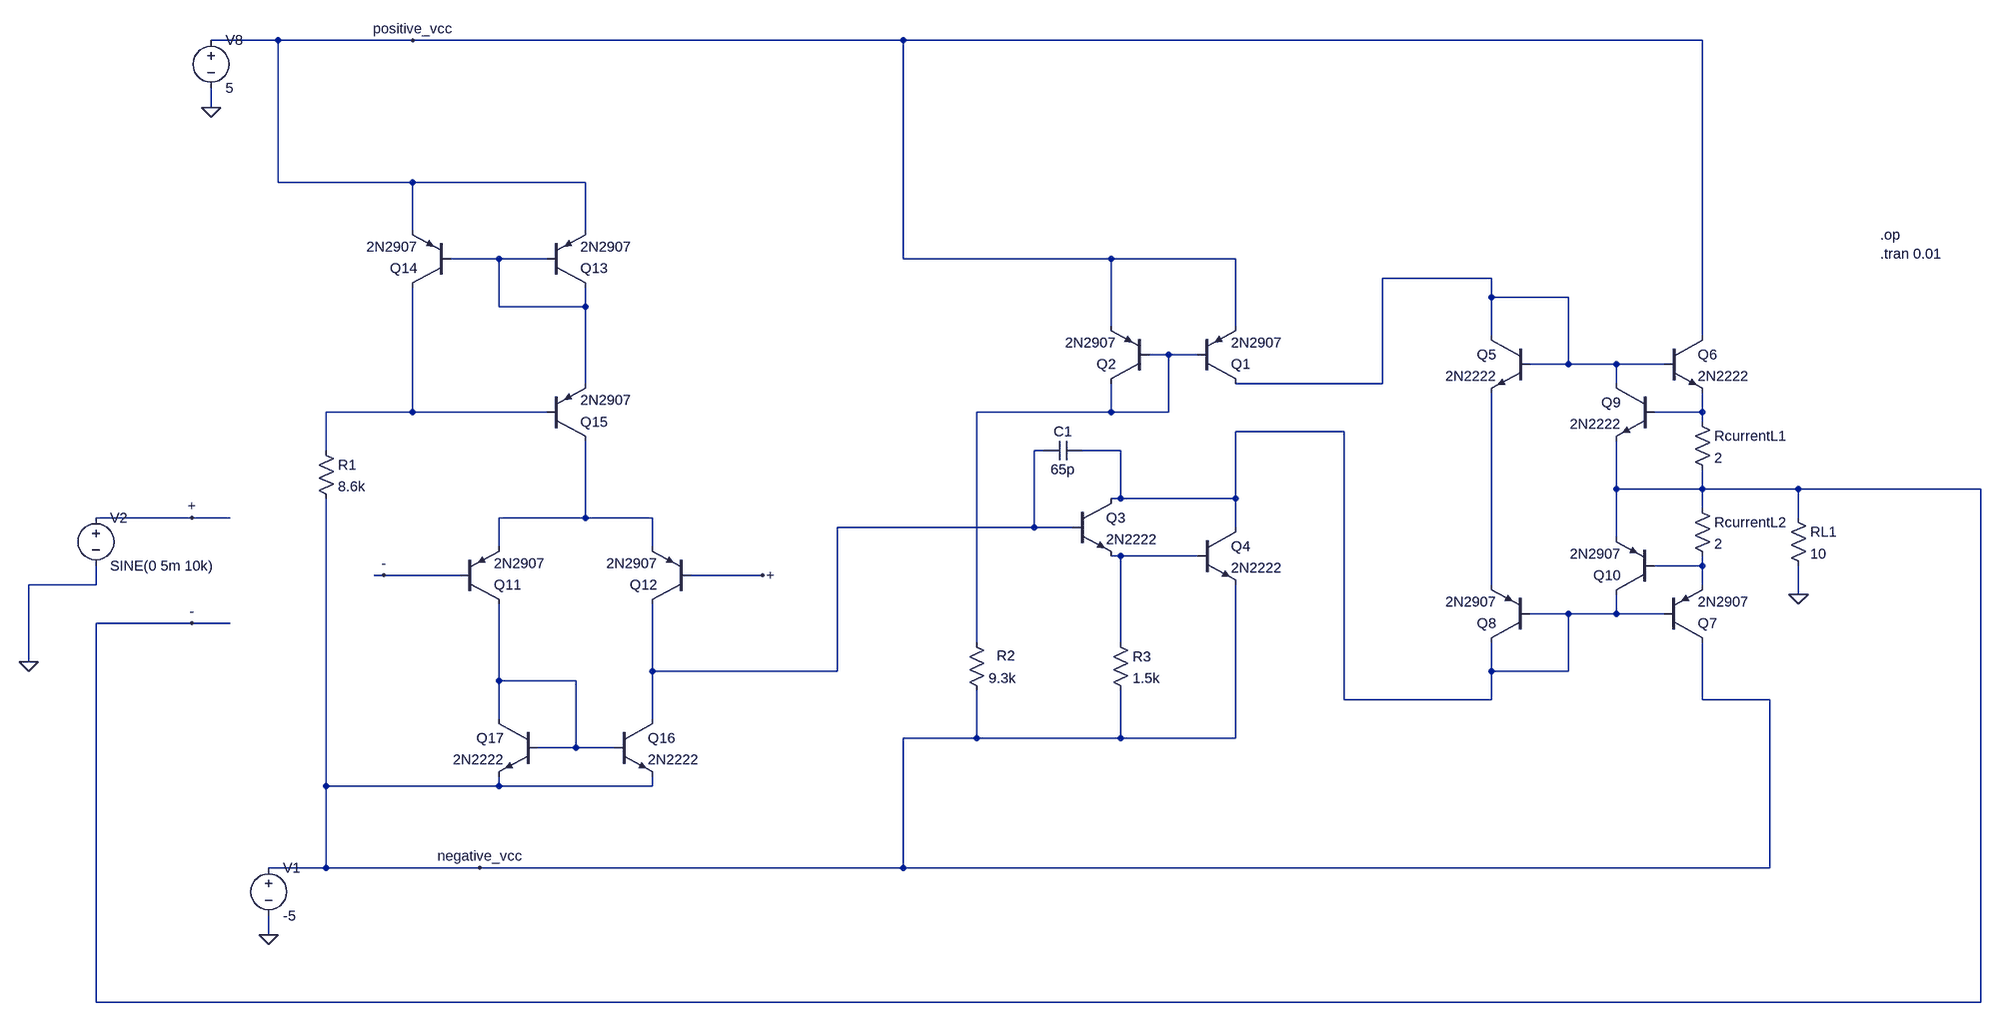
[diagram p0: schematic block3.asc]
block3.asc, the LTspice schematic file:
Version 4
SHEET 1 2168 2020
WIRE -1520 -672 -1632 -672
WIRE -1296 -672 -1520 -672
WIRE -208 -672 -1296 -672
WIRE 1440 -672 -208 -672
WIRE -1632 -560 -1632 -592
WIRE -1520 -160 -1520 -672
WIRE -1296 -160 -1520 -160
WIRE -1008 -160 -1296 -160
WIRE -1296 -80 -1296 -160
WIRE -1008 -80 -1008 -160
WIRE -1152 -32 -1232 -32
WIRE -1072 -32 -1152 -32
WIRE -208 -32 -208 -672
WIRE 192 -32 -208 -32
WIRE 400 -32 192 -32
WIRE 1088 0 848 0
WIRE 1088 32 1088 0
WIRE 1216 32 1088 32
WIRE -1152 48 -1152 -32
WIRE -1008 48 -1008 16
WIRE -1008 48 -1152 48
WIRE 192 80 192 -32
WIRE 400 80 400 -32
WIRE 1088 96 1088 32
WIRE 1440 96 1440 -672
WIRE 288 128 256 128
WIRE 336 128 288 128
WIRE 1216 144 1216 32
WIRE 1216 144 1152 144
WIRE 1296 144 1216 144
WIRE 1376 144 1296 144
WIRE -1008 176 -1008 48
WIRE 848 176 848 0
WIRE 848 176 400 176
WIRE 1296 176 1296 144
WIRE -1296 224 -1296 16
WIRE -1296 224 -1440 224
WIRE -1072 224 -1296 224
WIRE 192 224 192 176
WIRE 192 224 -32 224
WIRE 288 224 288 128
WIRE 288 224 192 224
WIRE 1440 224 1440 192
WIRE 1440 224 1360 224
WIRE 1440 240 1440 224
WIRE 784 256 400 256
WIRE -1440 288 -1440 224
WIRE 80 288 64 288
WIRE 208 288 144 288
WIRE 1296 352 1296 272
WIRE 1440 352 1440 320
WIRE 1440 352 1296 352
WIRE 1600 352 1440 352
WIRE 1904 352 1600 352
WIRE 208 368 208 288
WIRE 208 368 192 368
WIRE 400 368 400 256
WIRE 400 368 208 368
WIRE 1440 384 1440 352
WIRE -1664 400 -1824 400
WIRE -1600 400 -1664 400
WIRE -1008 400 -1008 272
WIRE -1008 400 -1152 400
WIRE -896 400 -1008 400
WIRE 1600 400 1600 352
WIRE 64 416 64 288
WIRE 64 416 -336 416
WIRE 128 416 64 416
WIRE 400 416 400 368
WIRE 1296 432 1296 352
WIRE -1152 448 -1152 400
WIRE -896 448 -896 400
WIRE 208 464 192 464
WIRE 336 464 208 464
WIRE 1440 480 1440 464
WIRE 1440 480 1360 480
WIRE -1344 496 -1360 496
WIRE -1216 496 -1344 496
WIRE -544 496 -832 496
WIRE -1824 512 -1824 480
WIRE -1824 512 -1936 512
WIRE 1088 512 1088 192
WIRE 1440 512 1440 480
WIRE 1600 528 1600 480
WIRE 1216 560 1152 560
WIRE 1296 560 1296 528
WIRE 1296 560 1216 560
WIRE 1376 560 1296 560
WIRE -1664 576 -1824 576
WIRE -1600 576 -1664 576
WIRE -32 608 -32 224
WIRE 208 608 208 464
WIRE -1936 640 -1936 512
WIRE -896 656 -896 544
WIRE -336 656 -336 416
WIRE -336 656 -896 656
WIRE 1088 656 1088 608
WIRE 1216 656 1216 560
WIRE 1216 656 1088 656
WIRE -1152 672 -1152 544
WIRE -1024 672 -1152 672
WIRE 784 704 784 256
WIRE 1088 704 1088 656
WIRE 1088 704 784 704
WIRE 1440 704 1440 608
WIRE 1552 704 1440 704
WIRE -1152 736 -1152 672
WIRE -896 736 -896 656
WIRE -32 768 -32 688
WIRE -32 768 -208 768
WIRE 208 768 208 688
WIRE 208 768 -32 768
WIRE 400 768 400 512
WIRE 400 768 208 768
WIRE -1024 784 -1024 672
WIRE -1024 784 -1088 784
WIRE -960 784 -1024 784
WIRE -1440 848 -1440 368
WIRE -1152 848 -1152 832
WIRE -1152 848 -1440 848
WIRE -896 848 -896 832
WIRE -896 848 -1152 848
WIRE -1440 1216 -1440 848
WIRE -1440 1216 -1536 1216
WIRE -1184 1216 -1440 1216
WIRE -208 1216 -208 768
WIRE -208 1216 -1184 1216
WIRE 1552 1216 1552 704
WIRE 1552 1216 -208 1216
WIRE -1536 1328 -1536 1296
WIRE -1824 1440 -1824 576
WIRE 1904 1440 1904 352
WIRE 1904 1440 -1824 1440
FLAG 1600 528 0
FLAG -544 496 +
FLAG -1344 496 -
FLAG -1632 -560 0
FLAG -1296 -672 positive_vcc
FLAG -1536 1328 0
FLAG -1184 1216 negative_vcc
FLAG -1664 400 +
FLAG -1664 576 -
FLAG -1936 640 0
SYMBOL npn 1152 96 M0
SYMATTR InstName Q5
SYMATTR Value 2N2222
SYMBOL npn 1376 96 R0
SYMATTR InstName Q6
SYMATTR Value 2N2222
SYMBOL pnp 1376 608 M180
SYMATTR InstName Q7
SYMATTR Value 2N2907
SYMBOL pnp 1152 608 R180
SYMATTR InstName Q8
SYMATTR Value 2N2907
SYMBOL npn 1360 176 M0
SYMATTR InstName Q9
SYMATTR Value 2N2222
SYMBOL pnp 1360 528 R180
SYMATTR InstName Q10
SYMATTR Value 2N2907
SYMBOL res 1424 224 R0
SYMATTR InstName RcurrentL1
SYMATTR Value 2
SYMBOL res 1424 368 R0
SYMATTR InstName RcurrentL2
SYMATTR Value 2
SYMBOL res 1584 384 R0
SYMATTR InstName RL1
SYMATTR Value 10
SYMBOL pnp 336 176 M180
SYMATTR InstName Q1
SYMATTR Value 2N2907
SYMBOL pnp 256 176 R180
SYMATTR InstName Q2
SYMATTR Value 2N2907
SYMBOL npn 128 368 R0
SYMATTR InstName Q3
SYMATTR Value 2N2222
SYMBOL npn 336 416 R0
SYMATTR InstName Q4
SYMATTR Value 2N2222
SYMBOL res -48 592 R0
WINDOW 0 49 38 Left 2
SYMATTR InstName R2
SYMATTR Value 9.3k
SYMBOL res 192 592 R0
SYMATTR InstName R3
SYMATTR Value 1.5k
SYMBOL pnp -1216 544 M180
SYMATTR InstName Q11
SYMATTR Value 2N2907
SYMBOL pnp -832 544 R180
SYMATTR InstName Q12
SYMATTR Value 2N2907
SYMBOL pnp -1072 16 M180
SYMATTR InstName Q13
SYMATTR Value 2N2907
SYMBOL pnp -1232 16 R180
SYMATTR InstName Q14
SYMATTR Value 2N2907
SYMBOL pnp -1072 272 M180
SYMATTR InstName Q15
SYMATTR Value 2N2907
SYMBOL res -1456 272 R0
SYMATTR InstName R1
SYMATTR Value 8.6k
SYMBOL npn -960 736 R0
SYMATTR InstName Q16
SYMATTR Value 2N2222
SYMBOL npn -1088 736 M0
SYMATTR InstName Q17
SYMATTR Value 2N2222
SYMBOL voltage -1632 -688 R0
SYMATTR InstName V8
SYMATTR Value 5
SYMBOL voltage -1536 1200 R0
SYMATTR InstName V1
SYMATTR Value -5
SYMBOL voltage -1824 384 R0
SYMATTR InstName V2
SYMATTR Value SINE(0 5m 10k)
SYMBOL cap 144 272 R90
WINDOW 0 0 32 VBottom 2
WINDOW 3 32 32 VTop 2
SYMATTR InstName C1
SYMATTR Value 65p
TEXT 1736 -72 Left 2 !.op\n.tran 0.01

The netlist it stands for:
* block3.asc
Q5 N002 N002 N011 0 2N2222
Q6 positive_vcc N002 N005 0 2N2222
Q7 negative_vcc N006 N010 0 2N2907
Q8 N006 N006 N011 0 2N2907
Q9 N002 N005 - 0 2N2222
Q10 N006 N010 - 0 2N2907
RcurrentL1 N005 - 2
RcurrentL2 - N010 2
RL1 - 0 10
Q1 N002 N003 positive_vcc 0 2N2907
Q2 N003 N003 positive_vcc 0 2N2907
Q3 N006 N007 N009 0 2N2222
Q4 N006 N009 negative_vcc 0 2N2222
R2 N003 negative_vcc 9.3k
R3 N009 negative_vcc 1.5k
Q11 N012 - N008 0 2N2907
Q12 N007 + N008 0 2N2907
Q13 N001 N001 positive_vcc 0 2N2907
Q14 N004 N001 positive_vcc 0 2N2907
Q15 N008 N004 N001 0 2N2907
R1 N004 negative_vcc 8.6k
Q16 N007 N012 negative_vcc 0 2N2222
Q17 N012 N012 negative_vcc 0 2N2222
V8 positive_vcc 0 5
V1 negative_vcc 0 -5
V2 + 0 SINE(0 5m 10k)
C1 N006 N007 65p
.model NPN NPN
.model PNP PNP
.lib standard.bjt
.op
.tran 0.01
.backanno
.end